# EAGLE schematic W101B (EAGLE 6.6.0)
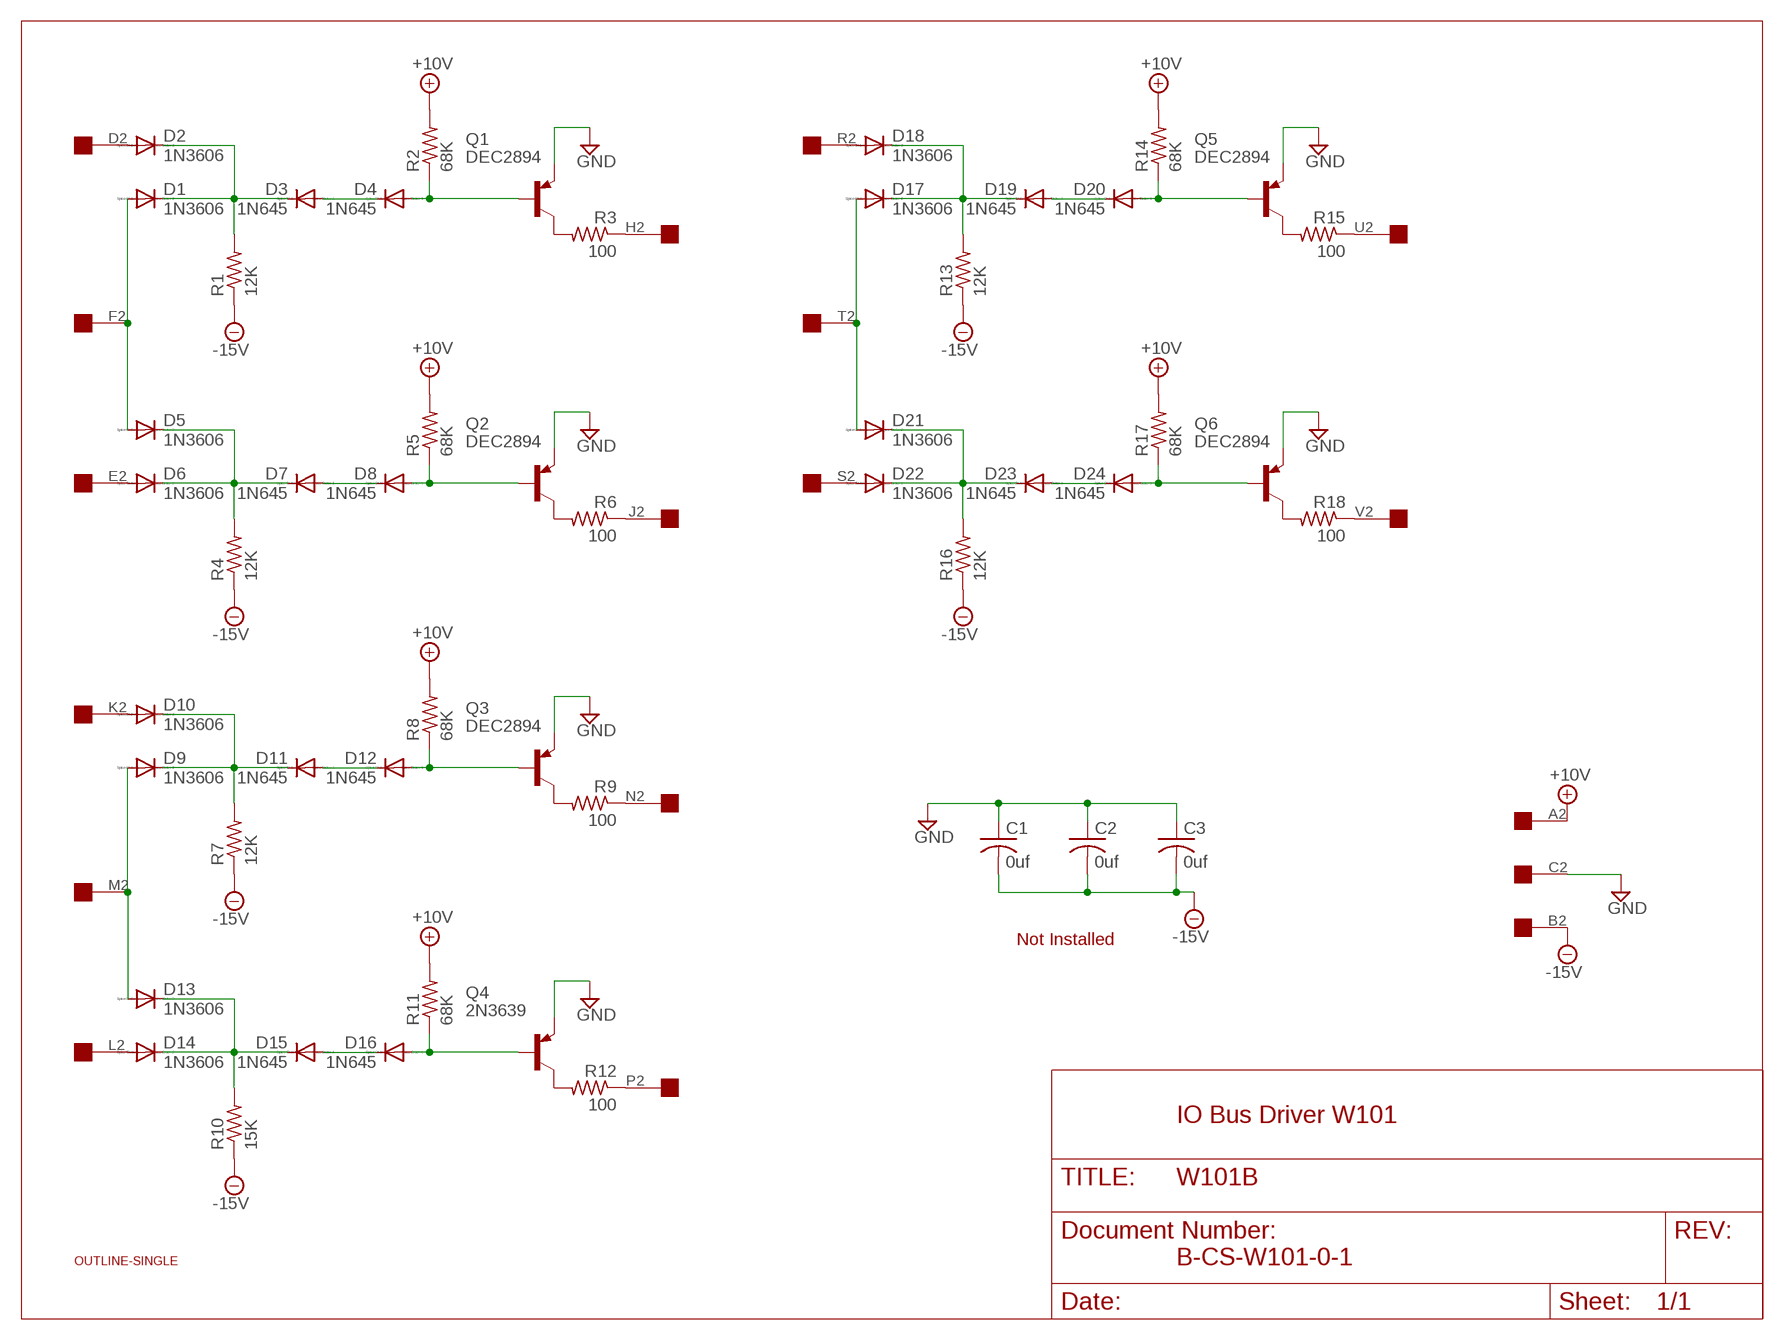
[diagram p0: schematic, sheet 1]

## Parts
C1  0uf  C-US050-025X075  [C050-025X075]
C2  0uf  C-US050-025X075  [C050-025X075]
C3  0uf  C-US050-025X075  [C050-025X075]
D1  1N3606  1N4148DO35-10  [DO35-10]
D2  1N3606  1N4148DO35-10  [DO35-10]
D3  1N645  1N4148DO35-10  [DO35-10]
D4  1N645  1N4148DO35-10  [DO35-10]
D5  1N3606  1N4148DO35-10  [DO35-10]
D6  1N3606  1N4148DO35-10  [DO35-10]
D7  1N645  1N4148DO35-10  [DO35-10]
D8  1N645  1N4148DO35-10  [DO35-10]
D9  1N3606  1N4148DO35-10  [DO35-10]
D10  1N3606  1N4148DO35-10  [DO35-10]
D11  1N645  1N4148DO35-10  [DO35-10]
D12  1N645  1N4148DO35-10  [DO35-10]
D13  1N3606  1N4148DO35-10  [DO35-10]
D14  1N3606  1N4148DO35-10  [DO35-10]
D15  1N645  1N4148DO35-10  [DO35-10]
D16  1N645  1N4148DO35-10  [DO35-10]
D17  1N3606  1N4148DO35-10  [DO35-10]
D18  1N3606  1N4148DO35-10  [DO35-10]
D19  1N645  1N4148DO35-10  [DO35-10]
D20  1N645  1N4148DO35-10  [DO35-10]
D21  1N3606  1N4148DO35-10  [DO35-10]
D22  1N3606  1N4148DO35-10  [DO35-10]
D23  1N645  1N4148DO35-10  [DO35-10]
D24  1N645  1N4148DO35-10  [DO35-10]
Q1  DEC2894  2N3637  [TO39]
Q2  DEC2894  2N3637  [TO39]
Q3  DEC2894  2N3637  [TO39]
Q4  2N3639  2N3637  [TO39]
Q5  DEC2894  2N3637  [TO39]
Q6  DEC2894  2N3637  [TO39]
R1  12K  R-US_0207/10  [0207/10]
R2  68K  R-US_0207/10  [0207/10]
R3  100  R-US_0207/10  [0207/10]
R4  12K  R-US_0207/10  [0207/10]
R5  68K  R-US_0207/10  [0207/10]
R6  100  R-US_0207/10  [0207/10]
R7  12K  R-US_0207/10  [0207/10]
R8  68K  R-US_0207/10  [0207/10]
R9  100  R-US_0207/10  [0207/10]
R10  15K  R-US_0207/10  [0207/10]
R11  68K  R-US_0207/10  [0207/10]
R12  100  R-US_0207/10  [0207/10]
R13  12K  R-US_0207/10  [0207/10]
R14  68K  R-US_0207/10  [0207/10]
R15  100  R-US_0207/10  [0207/10]
R16  12K  R-US_0207/10  [0207/10]
R17  68K  R-US_0207/10  [0207/10]
R18  100  R-US_0207/10  [0207/10]
U$1  OUTLINE-SINGLE  [SINGLE]
U$2  EDGE-1  [EDGE-CON1]

## Nets
+10V [Power]: R2.2 R5.2 R8.2 R11.2 R14.2 R17.2 U$2.A2
-15V [Power]: C1.2 C2.2 C3.2 R1.1 R4.1 R7.1 R10.1 R13.1 R16.1 U$2.B2
GND [Power]: C1.1 C2.1 C3.1 Q1.1(E) Q2.1(E) Q3.1(E) Q4.1(E) Q5.1(E) Q6.1(E) U$2.C2
N$1: D2.A U$2.D2
N$2: D8.A Q2.2(B) R5.1
N$3: R3.1 U$2.H2
N$4: Q2.3(C) R6.2
N$5: D6.A U$2.E2
N$6: D5.C D6.C D7.C R4.2
N$7: D7.A D8.C
N$8: D12.A Q3.2(B) R8.1
N$9: Q3.3(C) R9.2
N$10: D9.A D13.A U$2.M2
N$11: D9.C D10.C D11.C R7.2
N$12: D11.A D12.C
N$13: R6.1 U$2.J2
N$14: D10.A U$2.K2
N$15: R9.1 U$2.N2
N$16: R12.1 U$2.P2
N$17: D18.A U$2.R2
N$18: R15.1 U$2.U2
N$19: D4.A Q1.2(B) R2.1
N$20: Q1.3(C) R3.2
N$21: D1.A D5.A U$2.F2
N$22: D1.C D2.C D3.C R1.2
N$23: D3.A D4.C
N$24: D16.A Q4.2(B) R11.1
N$25: Q4.3(C) R12.2
N$26: D14.A U$2.L2
N$27: D13.C D14.C D15.C R10.2
N$28: D15.A D16.C
N$29: D20.A Q5.2(B) R14.1
N$30: Q5.3(C) R15.2
N$31: D17.A D21.A U$2.T2
N$32: D17.C D18.C D19.C R13.2
N$33: D19.A D20.C
N$34: D24.A Q6.2(B) R17.1
N$35: Q6.3(C) R18.2
N$36: D22.A U$2.S2
N$37: D21.C D22.C D23.C R16.2
N$38: D23.A D24.C
N$39: R18.1 U$2.V2

## Notes on the sheet
- Not Installed
- IO Bus Driver W101
- B-CS-W101-0-1

## Library data of the parts
C1-C3 = rcl:C-US: CAPACITOR, American symbol
D1-D24 = diode:1N4148: DIODE high speed (Philips)
Q1-Q6 = transistor-pnp:2N3637*: PNP Transistror
R1-R18 = rcl:R-US_: RESISTOR, American symbol
U$1 = dec-con:OUTLINE-*: Board outlines for DEC boards.
U$2 = dec-con:EDGE-1: Single-Sided DEC Edge Connector -- (side 2)

## Net classes
1 Power: width 0.813 mm